# EAGLE design Wiz810mjMikroBUS_SIL2 (EAGLE 6.4)
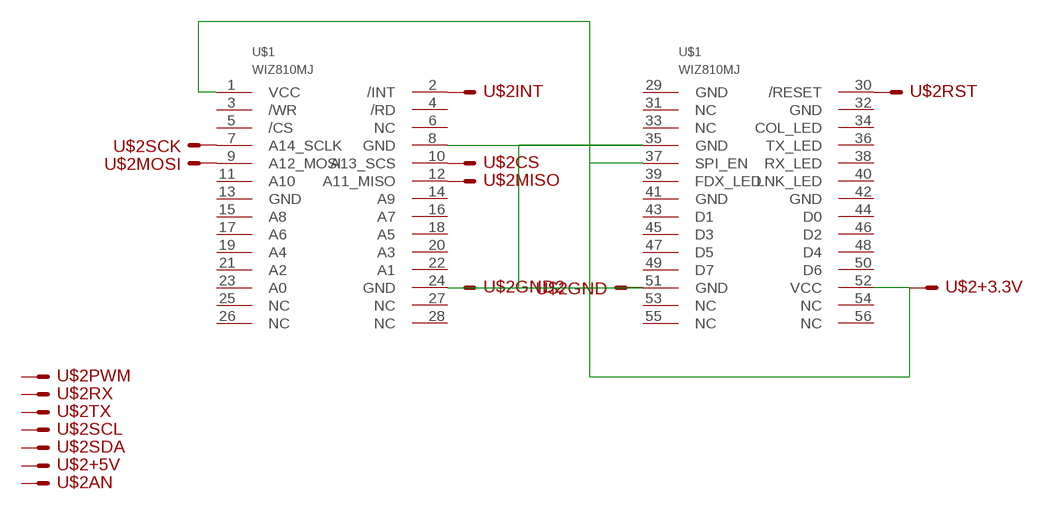
[diagram p0: schematic, sheet 1]

## Parts
U$1  WIZ810MJ  [WIZ810MJ]
U$2  MIKROBUSSIL  [MIKROBUS_SIL]

## Nets
N$1: U$1.2(/INT) U$2.INT
N$4: U$1.30(/RESET) U$2.RST
N$5: U$1.10(A13_SCS) U$2.CS
N$6: U$1.7(A14_SCLK) U$2.SCK
N$7: U$1.12(A11_MISO) U$2.MISO
N$8: U$1.9(A12_MOSI) U$2.MOSI
N$9: U$1.1(VCC) U$1.37(SPI_EN) U$1.52(VCC) U$2.+3.3V
N$27: U$1.8(GND) U$1.24(GND) U$1.35(GND) U$1.51(GND) U$2.GND U$2.GND2
Unconnected: U$1.3(/WR) U$1.4(/RD) U$1.5(/CS) U$1.6(NC) U$1.11(A10) U$1.13(GND) U$1.14(A9) U$1.15(A8) U$1.16(A7) U$1.17(A6) U$1.18(A5) U$1.19(A4) U$1.20(A3) U$1.21(A2) U$1.22(A1) U$1.23(A0) U$1.25(NC) U$1.26(NC) U$1.27(NC) U$1.28(NC) U$1.29(GND) U$1.31(NC) U$1.32(GND) U$1.33(NC) U$1.34(COL_LED) U$1.36(TX_LED) U$1.38(RX_LED) U$1.39(FDX_LED) U$1.40(LNK_LED) U$1.41(GND) U$1.42(GND) U$1.43(D1) U$1.44(D0) U$1.45(D3) U$1.46(D2) U$1.47(D5) U$1.48(D4) U$1.49(D7) U$1.50(D6) U$1.53(NC) U$1.54(NC) U$1.55(NC) U$1.56(NC) U$2.+5V U$2.AN U$2.PWM U$2.RX U$2.SCL U$2.SDA U$2.TX

## Library data of the parts
U$1 = WIZNET:WIZ810MJ
U$2 = lieven:MIKROBUS

## Board
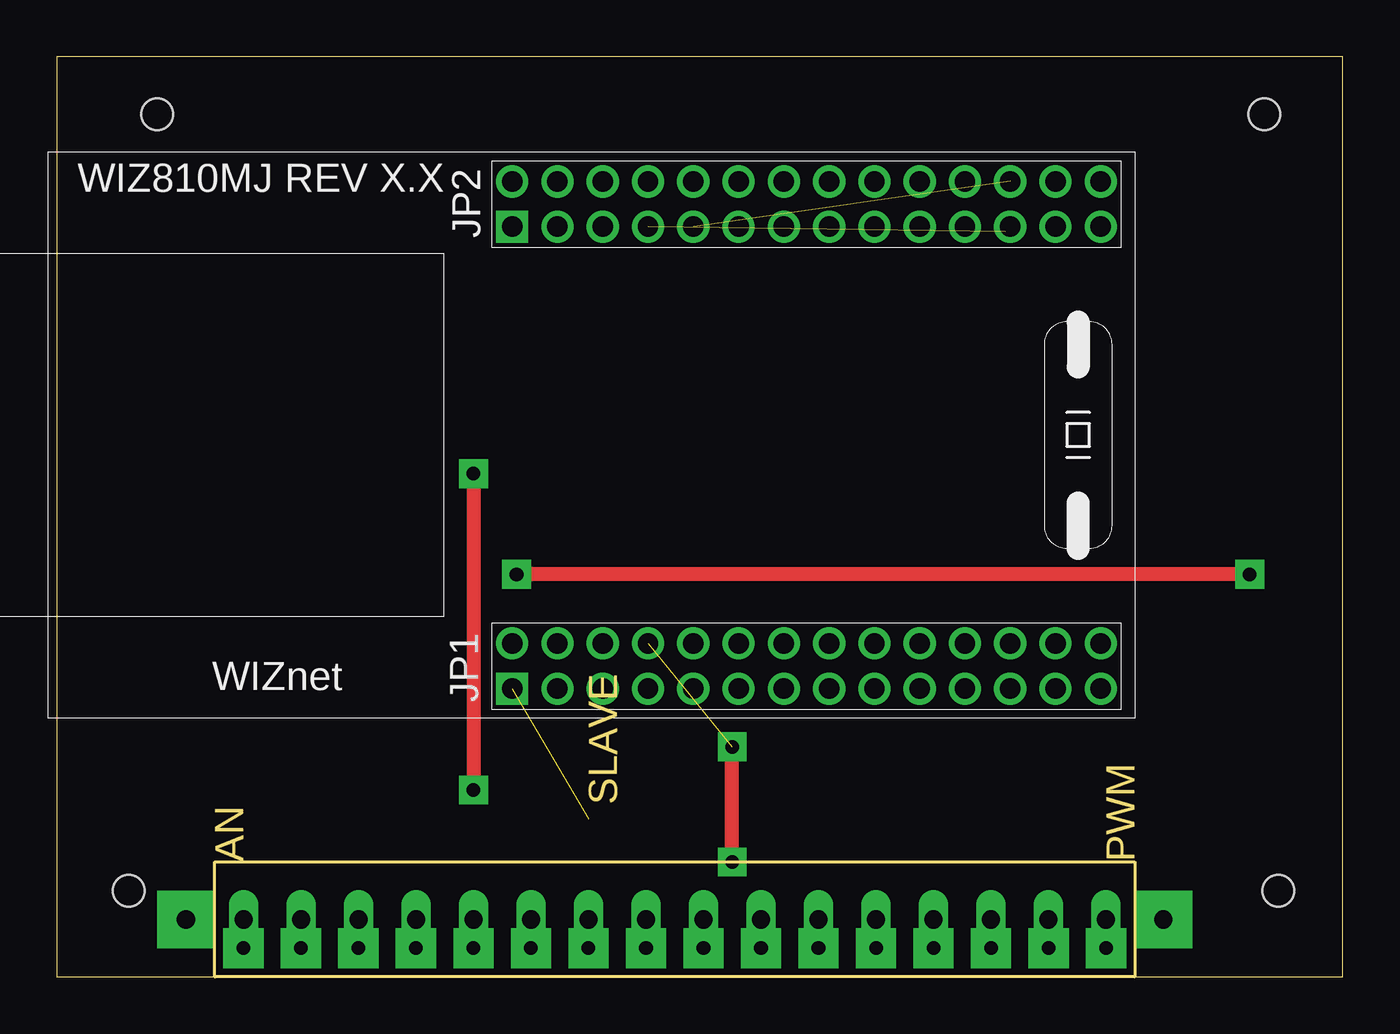
[diagram p1: board, top side]
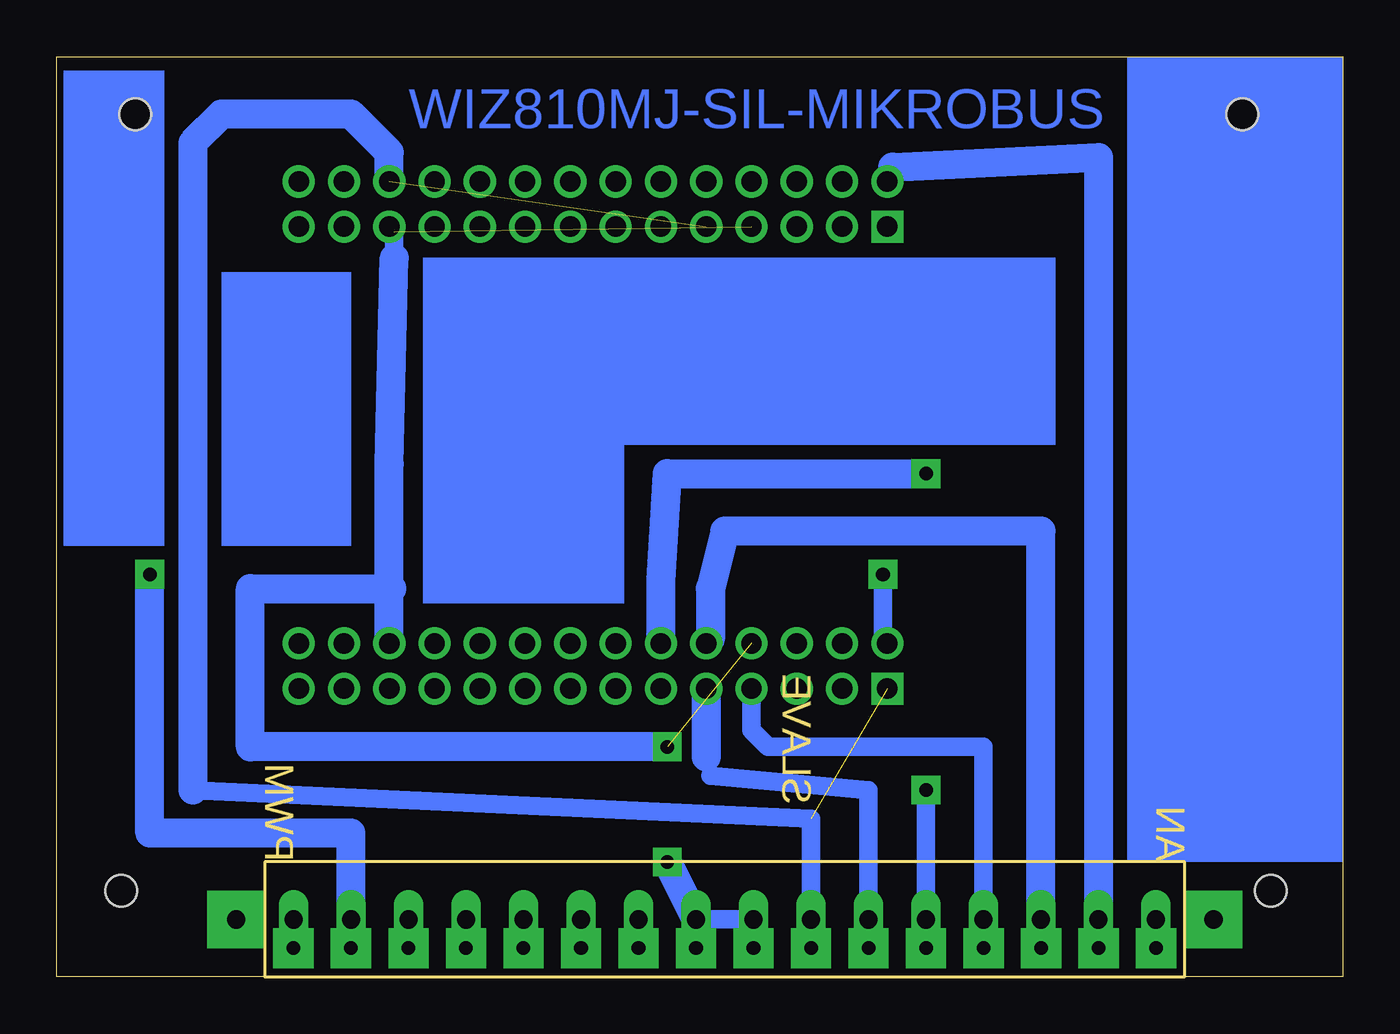
[diagram p2: board, bottom side, seen from below]

Size 56.82 x 40.63 mm. Coordinates in mm from the lower left corner, seen from the top.
Outline: 0,0 56.82,0 56.82,40.63 0,40.63 0,0
Copper layers (1*16): Top 0.035mm / dielectric 1.5mm / Bottom 0.035mm
Design rules "default": minimum track width 10mil, minimum drill 24mil, track to track 8mil, track to pad 8mil, pad to pad 8mil, via to via 8mil, smd to smd 8mil, copper to edge 40mil, drill to drill 8mil, minimum pad ring 10mil, minimum via ring 8mil, stop-mask expansion 4mil, vias tented up to drill 0mil, thermal gap 10mil
Holes 1.4 mm at 4.45,38.1 53.34,38.1 53.98,3.81 3.17,3.81

### Footprints (pad centres in the part's own frame; a part is rotated, then mirrored left to right if it is on the bottom)
WIZ810MJ = drill 0.9 pad 1.422 square: 1 27.5,-1.3; 29 27.5,-21.7 | drill 0.9 pad 1.422: 2 27.5,-3.3; 3 25.5,-1.3; 4 25.5,-3.3; 5 23.5,-1.3; 6 23.5,-3.3; 7 21.5,-1.3; 8 21.5,-3.3; 9 19.5,-1.3; 10 19.5,-3.3; 11 17.5,-1.3; 12 17.5,-3.3; 13 15.5,-1.3; 14 15.5,-3.3; 15 13.5,-1.3; 16 13.5,-3.3; 17 11.5,-1.3; 18 11.5,-3.3; 19 9.5,-1.3; 20 9.5,-3.3; 21 7.5,-1.3; 22 7.5,-3.3; 23 5.5,-1.3; 24 5.5,-3.3; 25 3.5,-1.3; 26 3.5,-3.3; 27 1.5,-1.3; 28 1.5,-3.3; 30 27.5,-23.7; 31 25.5,-21.7; 32 25.5,-23.7; 33 23.5,-21.7; 34 23.5,-23.7; 35 21.5,-21.7; 36 21.5,-23.7; 37 19.5,-21.7; 38 19.5,-23.7; 39 17.5,-21.7; 40 17.5,-23.7; 41 15.5,-21.7; 42 15.5,-23.7; 43 13.5,-21.7; 44 13.5,-23.7; 45 11.5,-21.7; 46 11.5,-23.7; 47 9.5,-21.7; 48 9.5,-23.7; 49 7.5,-21.7; 50 7.5,-23.7; 51 5.5,-21.7; 52 5.5,-23.7; 53 3.5,-21.7; 54 3.5,-23.7; 55 1.5,-21.7; 56 1.5,-23.7
MIKROBUS_SIL = drill 0.8 long: +3.3V 0,2.54; +5V 0,-5.08; AN 0,17.78; CS 0,12.7; GND 0,0; GND2 0,-2.54; INT 0,-17.78; MISO 0,7.62; MOSI 0,5.08; PWM 0,-20.32; RST 0,15.24; RX 0,-15.24; SCK 0,10.16; SCL 0,-10.16; SDA 0,-7.62; TX 0,-12.7 | drill 0.8 pad 2.54 square: P$3 0,20.32; P$4 0,-22.86

### Placement (x,y rotation side)
U$1  47.62,11.43 180 top
U$2  26.04,2.54 90 top

### Tracks (layer width: path | path; a pad name or v marks a point on that pad's centre or on a via)
N$1  (via drill 0.6 pad 1.27)
  Top 0.61: v52.71,17.78 v20.32,17.78
  Bottom 0.61: 20.32,14.93 U$1.2
  Bottom 0.813: v20.32,17.78 20.32,14.93
  Bottom 1.27: U$2.INT 43.82,6.35 52.71,6.35 v52.71,17.78
N$3  (via drill 0.6 pad 1.78)
  other vias: 8.26,1.27
N$4
  Bottom 0.61: U$1.30 19.89,35.77
  Bottom 1.27: 19.89,35.77 10.79,36.2 U$2.RST
N$5
  Bottom 0.61: 27.94,14.91 U$1.10
  Bottom 1.27: U$2.CS 13.34,19.69 27.3,19.69 27.94,17.14 27.94,14.91
N$6
  Bottom 0.813: U$1.7 26.12,10.89 25.4,10.16 15.88,10.16 U$2.SCK
N$7  (via drill 0.6 pad 1.27)
  Top 0.61: v18.41,22.23 v18.41,8.25
  Bottom 0.813: v18.41,8.25 U$2.MISO
  Bottom 1.27: U$1.12 30.12,17.5 29.84,22.23 v18.41,22.23
N$8
  Bottom 0.61: 28.12,9.71 27.94,8.89
  Bottom 0.813: 27.94,8.89 20.95,8.25 U$2.MOSI
  Bottom 1.27: U$1.9 28.12,9.71
N$9  (2 unrouted)
  Bottom 0.813: 50.8,8.25 23.49,6.99 U$2.+3.3V
  Bottom 1.27: U$1.52 42.12,36.41 43.82,38.1 49.53,38.1 50.8,36.83 50.8,8.25
N$10  (via drill 0.6 pad 1.78)
  other vias: 10.79,1.27
N$11  (via drill 0.6 pad 1.78)
  other vias: 13.34,1.27
N$12  (via drill 0.6 pad 1.78)
  other vias: 15.88,1.27
N$13  (via drill 0.6 pad 1.78)
  other vias: 18.41,1.27
N$14  (via drill 0.6 pad 1.78)
  other vias: 20.95,1.27
N$15  (via drill 0.6 pad 1.78)
  other vias: 23.49,1.27
N$16  (via drill 0.6 pad 1.78)
  other vias: 26.04,1.27
N$17  (via drill 0.6 pad 1.78)
  other vias: 28.57,1.27
N$18  (via drill 0.6 pad 1.78)
  other vias: 31.11,1.27
N$19  (via drill 0.6 pad 1.78)
  other vias: 33.66,1.27
N$20  (via drill 0.6 pad 1.78)
  other vias: 36.2,1.27
N$21  (via drill 0.6 pad 1.78)
  other vias: 38.73,1.27
N$22  (via drill 0.6 pad 1.78)
  other vias: 41.27,1.27
N$23  (via drill 0.6 pad 1.78)
  other vias: 43.82,1.27
N$24  (via drill 0.6 pad 1.78)
  other vias: 46.36,1.27
N$27  (via drill 0.6 pad 1.27)  (2 unrouted)
  Top 0.61: v29.84,5.08 v29.84,10.16
  Bottom 0.61: 42,17.14 U$1.24 | 41.91,32.91 U$1.51
  Bottom 0.813: U$2.GND U$2.GND2 | 41.91,31.75 41.91,32.91
  Bottom 1.27: U$2.GND2 v29.84,5.08 | v29.84,10.16 48.26,10.16 48.26,17.14 42,17.14 | U$1.24 42.12,22.64 41.91,31.75
(copper drawn outside any net)
  shapes: Bottom area x7

### Text on the board
Bottom: WIZ810MJ-SIL-MIKROBUS